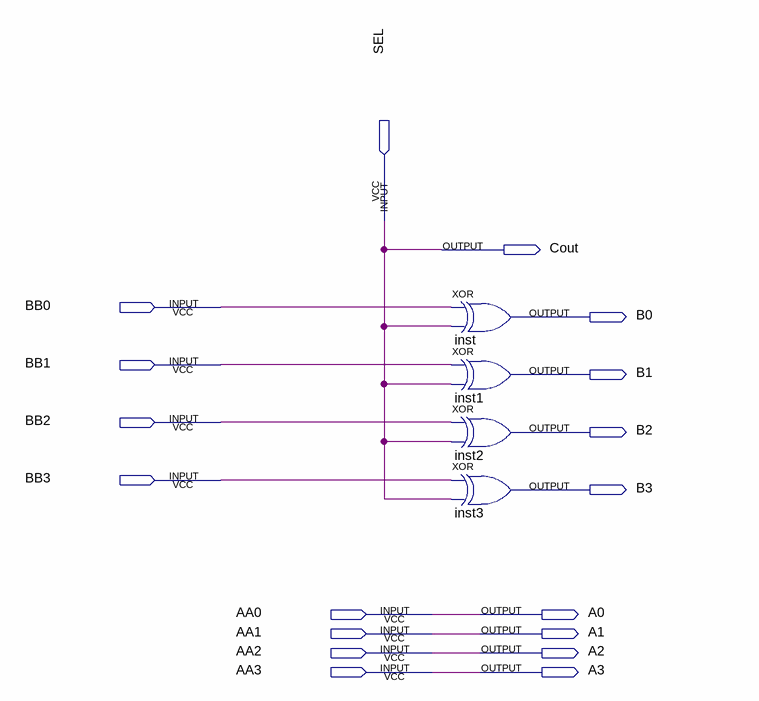
[diagram p0: schematic sheet]
// Quartus schematic CRES4Bit.bdf as structural Verilog: 4 symbols, 18 pins
module CRES4Bit (
  input  SEL,
  input  BB0,
  input  BB1,
  input  BB2,
  input  BB3,
  input  AA0,
  input  AA1,
  input  AA2,
  input  AA3,
  output Cout,
  output B0,
  output B1,
  output B2,
  output B3,
  output A0,
  output A1,
  output A2,
  output A3
);

  xor inst (B0, BB0, SEL);
  xor inst1 (B1, BB1, SEL);
  xor inst2 (B2, BB2, SEL);
  xor inst3 (B3, BB3, SEL);

  assign A0 = AA0;
  assign A1 = AA1;
  assign A2 = AA2;
  assign A3 = AA3;
  assign Cout = SEL;
endmodule
